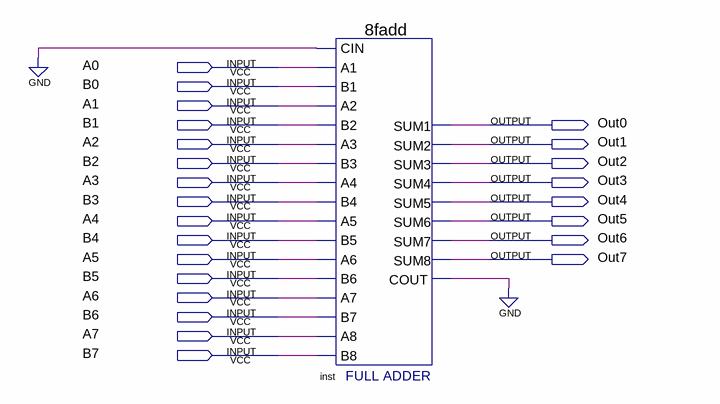
[diagram p0: schematic sheet]
// Quartus schematic FA8_N.bdf as structural Verilog: 1 symbols, 24 pins
module FA8_N (
  input  A0,
  input  B0,
  input  A1,
  input  B1,
  input  A2,
  input  B2,
  input  A3,
  input  B3,
  input  A4,
  input  B4,
  input  A5,
  input  B5,
  input  A6,
  input  B6,
  input  A7,
  input  B7,
  output Out0,
  output Out1,
  output Out2,
  output Out3,
  output Out4,
  output Out5,
  output Out6,
  output Out7
);

  wire inst_cout;

  \8fadd  inst (
    .A1(A0), .A3(A2), .CIN(1'b0), .B1(B0), .A2(A1), .B2(B1), .A4(A3), .B4(B3), .A5(A4), .A7(A6), .B6(B5),
    .B3(B2), .B8(B7), .B5(B4), .A6(A5), .B7(B6), .A8(A7), .SUM2(Out1), .SUM5(Out4), .SUM6(Out5), .SUM1(Out0),
    .COUT(inst_cout), .SUM3(Out2), .SUM4(Out3), .SUM7(Out6), .SUM8(Out7));
  // also tied to GND on the sheet: inst_cout
endmodule
